# Altium schematic sheet Power.SchDoc
size A4; SheetNumber: 6; SheetTotal: 7
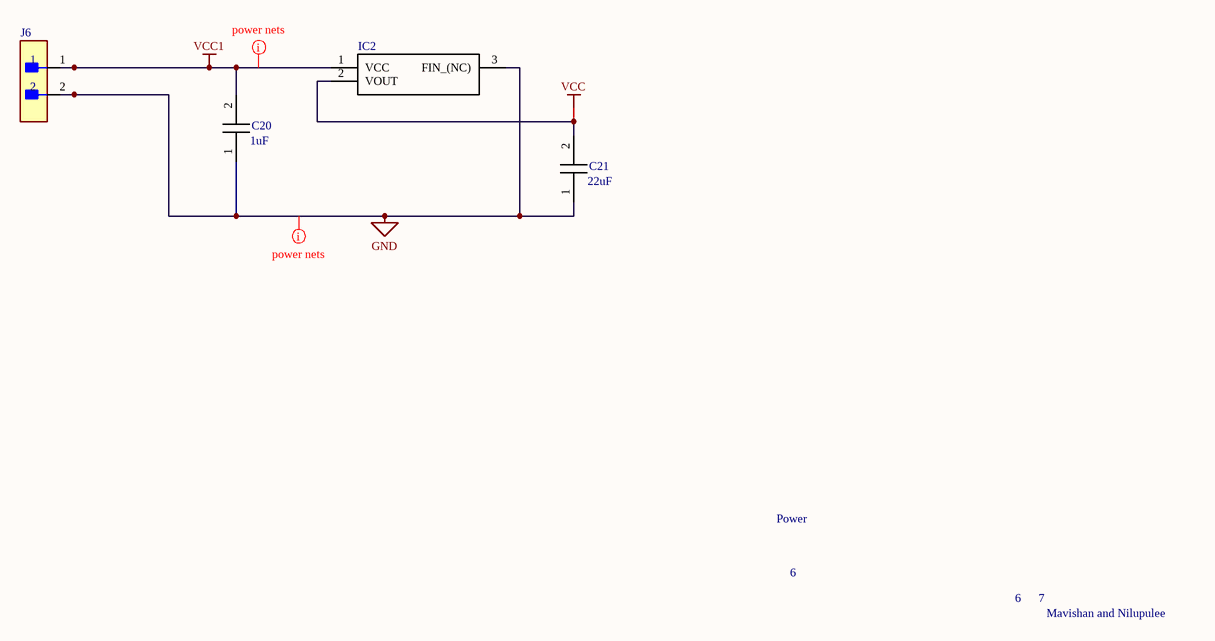
[diagram p0: Power.SchDoc]

## Parts
C20  Parameter 1: 1uF  [CAPC3216X178N]  (hidden comment: 12063C105MAT2A)
C21  Parameter 1: 22uF  [CAPC3216X229N]  (hidden comment: 12063D226MAT2A)
IC2  BD450M5FP-CE2  [ROHM_TO-252-3]  (value not drawn)
J6  B2B-XH-A(LF)(SN)  [FP-B2B-XH-A_LF_SN-MFG]  (value not drawn)

## Nets
GND: C20.1 C21.1 IC2.3(FIN_(NC)) J6.2
VCC: C21.2 IC2.2(VOUT)
VCC1: C20.2 IC2.1(VCC) J6.1

## Layout directives
net class name: PowerNets; net class PowerNets: GND, VCC1

## Notes on the sheet
- Power
- 6
- 7
- Mavishan and Nilupulee

## Library data of the parts
C20 = 12063C105MAT2A: Capacitor; Manufacturer_Name: Kyocera AVX; Datasheet Link: https://spicat.kyocera-avx.com/product/mlcc/chartview/12063C105MAT2A/DataSheet/X7R; Height: 1.78mm; Manufacturer_Part_Number: 12063C105MAT2A; Mouser Part Number: 581-12063C105MAT2A; Mouser Price/Stock: https://www.mouser.com/Search/Refine.aspx?Keyword=581-12063C105MAT2A; Arrow Part Number: 12063C105MAT2A; Arrow Price/Stock: https://www.arrow.com/en/products/12063c105mat2a/avx
C21 = 12063D226MAT2A: Capacitor; Manufacturer_Name: Kyocera AVX; Datasheet Link: https://rs.componentsearchengine.com/Datasheets/1/12063D226MAT2A.pdf; Height: 2.29mm; Manufacturer_Part_Number: 12063D226MAT2A; Mouser Part Number: 581-12063D226MAT2A; Mouser Price/Stock: https://www.mouser.co.uk/ProductDetail/KYOCERA-AVX/12063D226MAT2A?qs=q%252BHV0zBR8MiKBGAgbZK5Jw%3D%3D; Arrow Part Number: 12063D226MAT2A; Arrow Price/Stock: https://www.arrow.com/en/products/12063d226mat2a/avx?region=nac
IC2 = BD450M5FP-CE2: Integrated Circuit; Manufacturer_Name: ROHM Semiconductor; Datasheet Link: https://datasheet.datasheetarchive.com/originals/distributors/DKDS-10/186386.pdf; Manufacturer_Part_Number: BD450M5FP-CE2; Mouser Part Number: 755-BD450M5FP-CE2; Mouser Price/Stock: https://www.mouser.co.uk/ProductDetail/ROHM-Semiconductor/BD450M5FP-CE2?qs=zGux8KhMp6L1UcqyCxjOAw%3D%3D
J6 = CMP-2000-05888-3: CONN HEADER VERT 2POS 2.5MM; Current Rating: 3A; Voltage Rating: 250V; Number of Contacts: 2; Contact Resistance: 20mR; Wire/Cable Gauge: 22AWG; Insulation Resistance: 1GR; Connector Type: Male Pin; Packaging: Bulk; Contact Material: Brass; Lead Free: Lead Free; Orientation: Straight; Contact Plating: Tin; Max Current Rating: 3A; Termination: Solder; Fastening Type: Detent; Depth: 5.75mm; Housing Material: Polyamide; REACH SVHC: No SVHC; Series: XH; Voltage Rating (AC): 250V; Number of Positions: 2; Color: Natural; Contact Type: Male Pin; Max Voltage Rating (DC): 250V; Pitch: 2.5mm; Lead Pitch: 2.5mm; Mount: Through Hole; Max Operating Temperature: 85°C; Length: 7.4mm; Max Voltage Rating (AC): 250V; Min Operating Temperature: -25°C; Number of Rows: 1; Housing Color: White